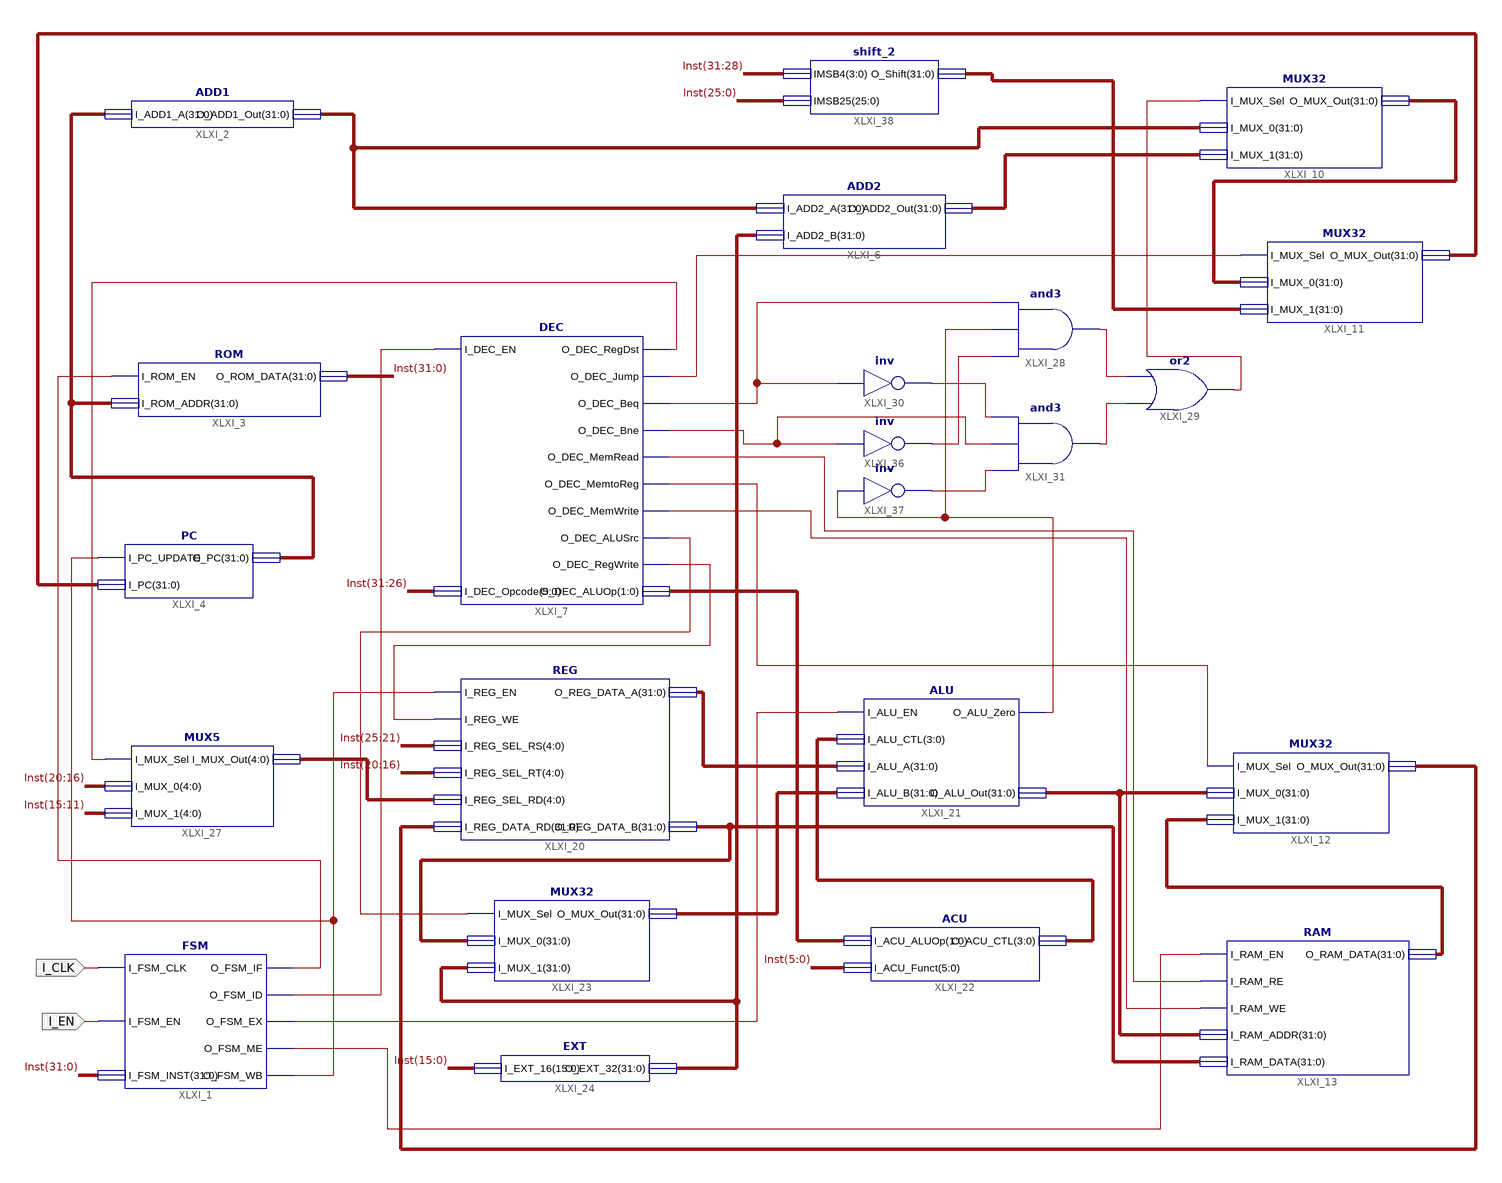
[diagram p0: schematic sheet 1]
// Xilinx ISE schematic CCSiMP32a.sch (artix7) as structural Verilog: 23 symbols, 2 ports
module CCSiMP32a (
  input  I_CLK,
  input  I_EN
);

  wire XLXN_10, XLXN_22, XLXN_26, XLXN_29, XLXN_36, XLXN_46, XLXN_47, XLXN_48, XLXN_49, XLXN_51, XLXN_52,
       XLXN_53, XLXN_54, XLXN_56, XLXN_62, XLXN_69, XLXN_78, XLXN_79, XLXN_80, XLXN_81, XLXN_82;
  wire [1:0] XLXN_32;
  wire [3:0] XLXN_31;
  wire [4:0] XLXN_11;
  wire [31:0] Inst, XLXN_3, XLXN_12, XLXN_13, XLXN_17, XLXN_21, XLXN_27, XLXN_34, XLXN_35, XLXN_38, XLXN_67,
       XLXN_71, XLXN_90, XLXN_96;

  FSM XLXI_1 (
    .I_FSM_CLK(I_CLK), .I_FSM_EN(I_EN), .I_FSM_INST(Inst), .O_FSM_IF(XLXN_22), .O_FSM_ID(XLXN_26),
    .O_FSM_EX(XLXN_36), .O_FSM_ME(XLXN_82), .O_FSM_WB(XLXN_81));
  ADD1 XLXI_2 (.I_ADD1_A(XLXN_3), .O_ADD1_Out(XLXN_17));
  ROM XLXI_3 (.I_ROM_EN(XLXN_22), .I_ROM_ADDR(XLXN_3), .O_ROM_DATA(Inst));
  PC XLXI_4 (.I_PC_UPDATE(XLXN_81), .I_PC(XLXN_67), .O_PC(XLXN_3));
  DEC XLXI_7 (
    .I_DEC_EN(XLXN_26), .I_DEC_Opcode(Inst[31:26]), .O_DEC_RegDst(XLXN_10), .O_DEC_Jump(XLXN_69),
    .O_DEC_Beq(XLXN_47), .O_DEC_Bne(XLXN_49), .O_DEC_MemRead(XLXN_78), .O_DEC_MemtoReg(XLXN_29),
    .O_DEC_MemWrite(XLXN_79), .O_DEC_ALUSrc(XLXN_46), .O_DEC_RegWrite(XLXN_80), .O_DEC_ALUOp(XLXN_32));
  MUX32 XLXI_11 (.I_MUX_Sel(XLXN_69), .I_MUX_0(XLXN_71), .I_MUX_1(XLXN_96), .O_MUX_Out(XLXN_67));
  MUX32 XLXI_10 (.I_MUX_Sel(XLXN_62), .I_MUX_0(XLXN_17), .I_MUX_1(XLXN_21), .O_MUX_Out(XLXN_71));
  REG XLXI_20 (
    .I_REG_EN(XLXN_81), .I_REG_WE(XLXN_80), .I_REG_SEL_RS(Inst[25:21]), .I_REG_SEL_RT(Inst[20:16]),
    .I_REG_SEL_RD(XLXN_11), .I_REG_DATA_RD(XLXN_27), .O_REG_DATA_A(XLXN_90), .O_REG_DATA_B(XLXN_38));
  ALU XLXI_21 (
    .I_ALU_EN(XLXN_36), .I_ALU_CTL(XLXN_31), .I_ALU_A(XLXN_90), .I_ALU_B(XLXN_34), .O_ALU_Zero(XLXN_52),
    .O_ALU_Out(XLXN_13));
  ACU XLXI_22 (.I_ACU_ALUOp(XLXN_32), .I_ACU_Funct(Inst[5:0]), .O_ACU_CTL(XLXN_31));
  MUX32 XLXI_23 (.I_MUX_Sel(XLXN_46), .I_MUX_0(XLXN_38), .I_MUX_1(XLXN_35), .O_MUX_Out(XLXN_34));
  EXT XLXI_24 (.I_EXT_16(Inst[15:0]), .O_EXT_32(XLXN_35));
  MUX32 XLXI_12 (.I_MUX_Sel(XLXN_29), .I_MUX_0(XLXN_13), .I_MUX_1(XLXN_12), .O_MUX_Out(XLXN_27));
  RAM XLXI_13 (
    .I_RAM_EN(XLXN_82), .I_RAM_RE(XLXN_78), .I_RAM_WE(XLXN_79), .I_RAM_ADDR(XLXN_13), .I_RAM_DATA(XLXN_38),
    .O_RAM_DATA(XLXN_12));
  MUX5 XLXI_27 (.I_MUX_Sel(XLXN_10), .I_MUX_0(Inst[20:16]), .I_MUX_1(Inst[15:11]), .I_MUX_Out(XLXN_11));
  ADD2 XLXI_6 (.I_ADD2_A(XLXN_17), .I_ADD2_B(XLXN_35), .O_ADD2_Out(XLXN_21));
  and XLXI_31 (XLXN_56, XLXN_53, XLXN_49, XLXN_48);
  and XLXI_28 (XLXN_54, XLXN_51, XLXN_52, XLXN_47);
  or XLXI_29 (XLXN_62, XLXN_56, XLXN_54);
  not XLXI_37 (XLXN_53, XLXN_52);
  not XLXI_36 (XLXN_51, XLXN_49);
  not XLXI_30 (XLXN_48, XLXN_47);
  shift_2 XLXI_38 (.IMSB4(Inst[31:28]), .IMSB25(Inst[25:0]), .O_Shift(XLXN_96));
endmodule
